# EAGLE design blink1-ws2812-adapter2f (EAGLE 8.4.2)
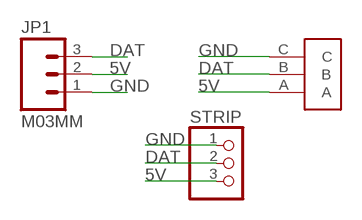
[diagram p0: schematic, sheet 1]

## Parts
JP1  M03MM  [1X03-1.5MM]
STRIP  PINHD-1X3  [1X03]
U$1  LED_STRIP_3P  [LEDSTRIP-3P]

## Nets
5V: JP1.2 STRIP.3 U$1.A
DAT: JP1.3 STRIP.2 U$1.B
GND: JP1.1 STRIP.1 U$1.C

## Library data of the parts
JP1 = todstuff:M03
STRIP = adafruit:PINHD-1X3: PIN HEADER
U$1 = todstuff:LED_STRIP_3P

## Board
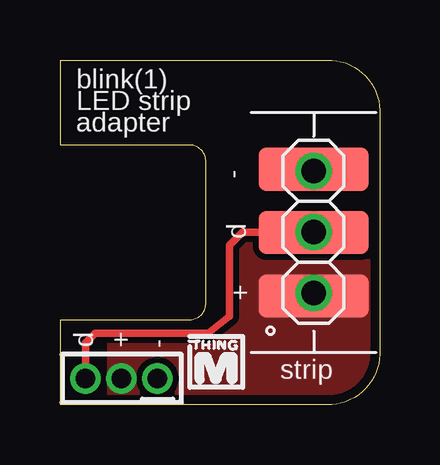
[diagram p1: board, top side]
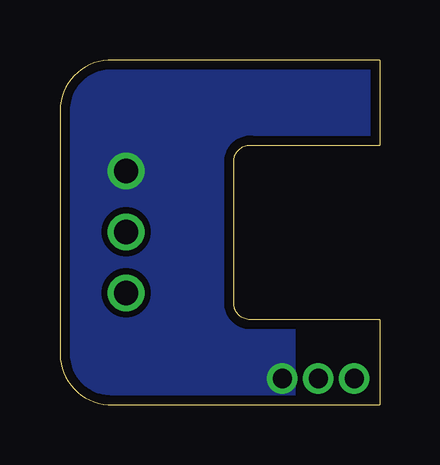
[diagram p2: board, bottom side, seen from below]

Size 13.34 x 14.36 mm. Coordinates in mm from the lower left corner, seen from the top.
Outline: 0,14.36 0,10.82 5.35,10.82 arc-90 6.09,10.18 6.09,4.18 arc-90 5.35,3.55 0,3.55 0,0 11.33,0 arc90 13.33,2.3 13.33,12.06 arc90 11.33,14.36 0,14.36
Copper layers (1*16): Top 0.0356mm / dielectric 1.5011mm / Bottom 0.0356mm
Design rules "LaenPCBOrderTodTent": minimum track width 6mil, minimum drill 13mil, track to track 6mil, track to pad 6mil, pad to pad 6mil, via to via 6mil, smd to smd 6mil, copper to edge 15mil, drill to drill 6mil, minimum pad ring 7mil, minimum via ring 7mil, stop-mask expansion 3mil, vias tented up to drill 20mil, thermal gap 10mil

### Footprints (pad centres in the part's own frame; a part is rotated, then mirrored left to right if it is on the bottom)
1X03-1.5MM = drill 0.8 pad 1.27: 1 0,0; 2 1.5,0; 3 3,0
1X03 = drill 1.016: 1 -2.54,0; 2 0,0; 3 2.54,0
LEDSTRIP-3P = smd 4.6 x 1.8: A 0,-2.65; B 0,0; C 0,2.63

### Placement (x,y rotation side)
JP1  4.06,1.09 180 top
STRIP  10.58,7.2 270 top
U$1  10.58,7.18 0 top

### Tracks (layer width: path | path; a pad name or v marks a point on that pad's centre or on a via)
5V
  Top 0.305: U$1.A STRIP.3
  pour Top (isolate 0.254, no thermals): 2.1,3.67 3.81,3.67 5.08,4.64 5.08,9.72 3.81,10.69 0,10.69 0,15.06 13.97,15.06 13.97,-1.21 2.1,-1.11
DAT
  Top 0.152: STRIP.2 10.69,7.18 U$1.B
  Top 0.305: JP1.3 1.06,2.57 1.47,2.98 6.17,2.98 7.07,3.68 7.07,6.64 7.62,7.18 U$1.B
GND
  Top 0.305: U$1.C STRIP.1
  pour Bottom (isolate 0.254, no thermals): 0,15.06 13.64,15.06 13.54,-1.21 3.63,-1.21 3.63,4.39 3.74,4.59 3.81,4.64 3.81,9.72 2.54,10.69 0,10.69

### Text on the board
tPlace: blink(1) | LED strip | adapter | - | d | + | d | + | - | strip